# EAGLE board h7-disco (EAGLE 7.7.0)
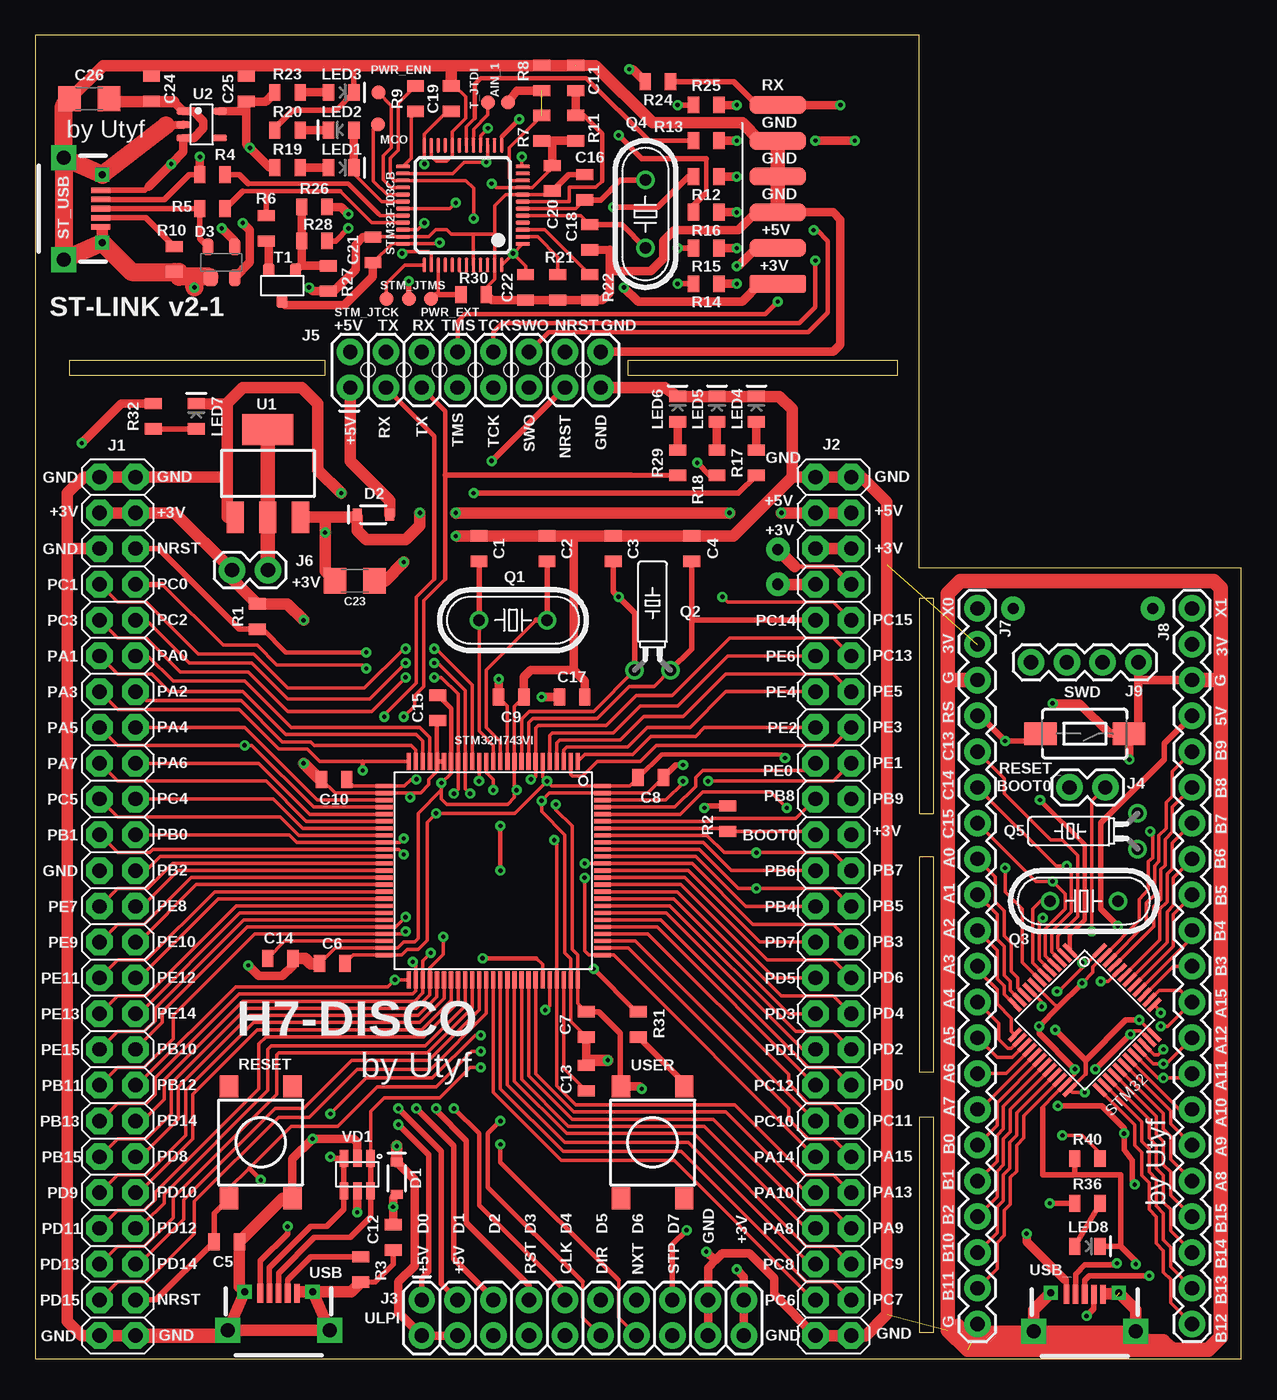
[diagram p1: board, top side]
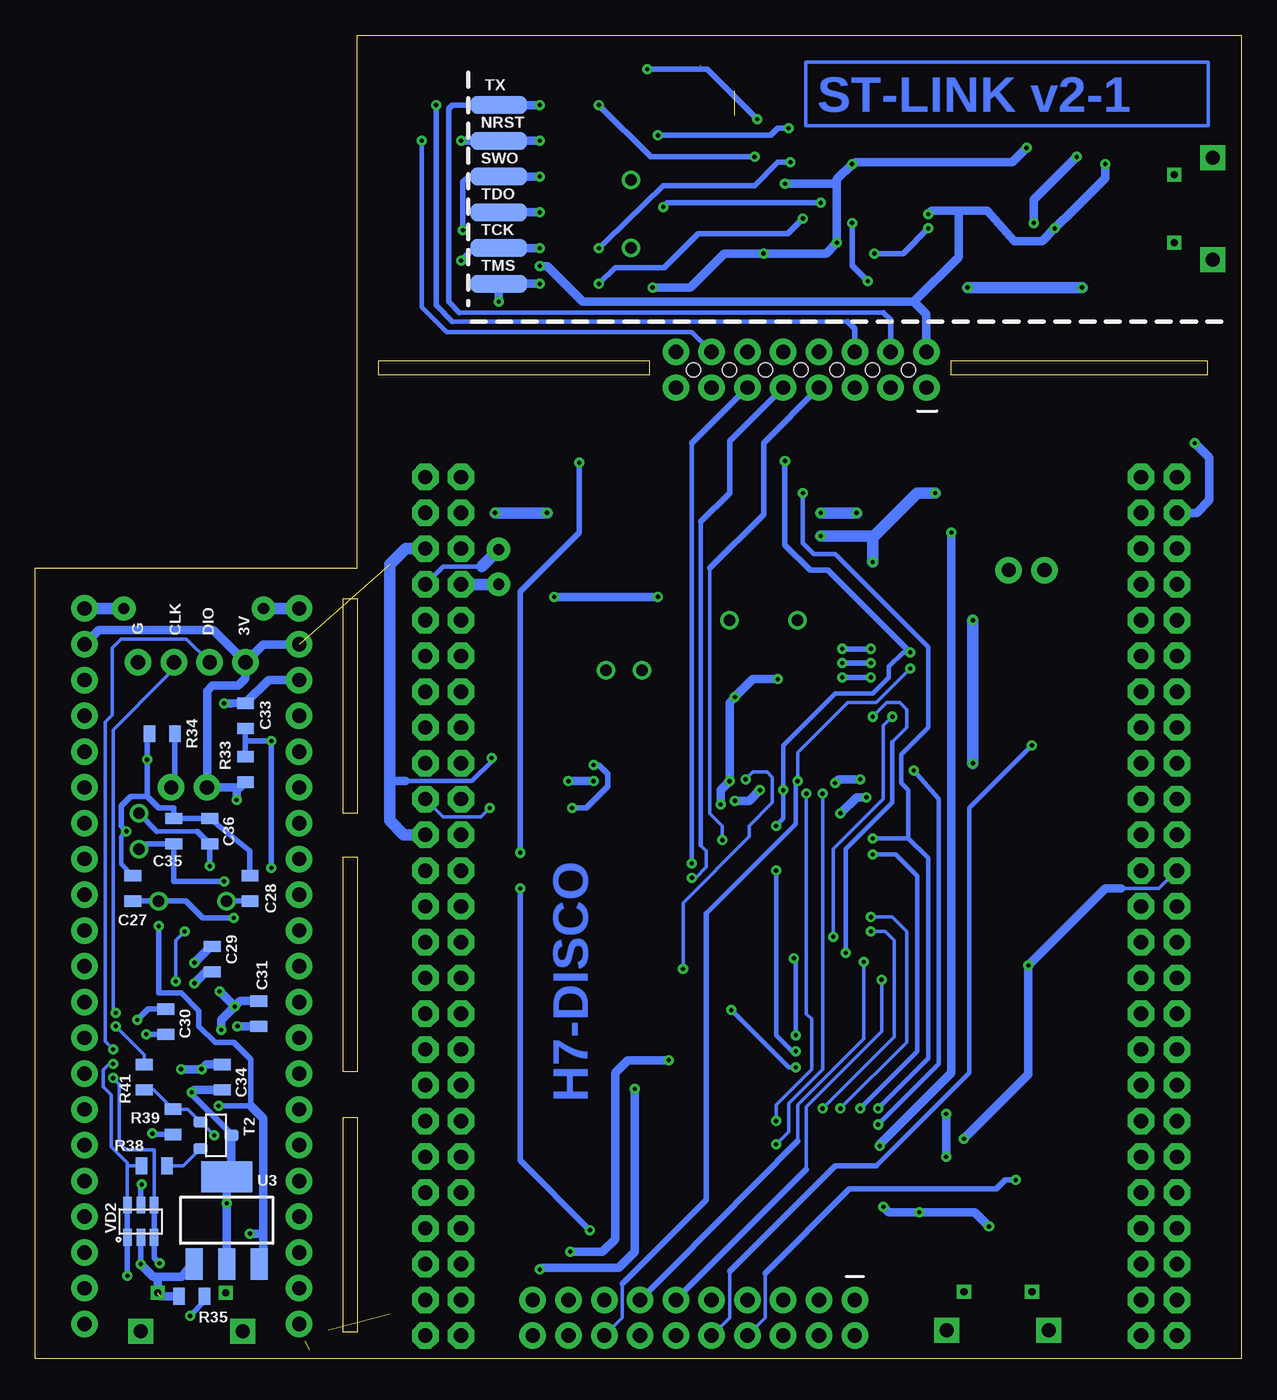
[diagram p2: board, bottom side, seen from below]

Size 85.6 x 93.98 mm. Coordinates in mm from the lower left corner, seen from the top.
Outline: 0,0 85.6,0 85.6,56.13 62.74,56.13 62.74,93.98 0,93.98 0,0
Copper layers (1*16): Top 0.035mm / dielectric 1.5mm / Bottom 0.035mm
Design rules "default *": minimum track width 8mil, minimum drill 12mil, track to track 7mil, track to pad 7mil, pad to pad 7mil, via to via 7mil, smd to smd 7mil, copper to edge 4mil, drill to drill 4mil, minimum pad ring 10mil, minimum via ring 8mil, stop-mask expansion 4mil, vias tented up to drill 0mil, thermal gap 10mil
Holes 1 mm at 23.62,70.23 26.16,70.23 28.7,70.23 31.24,70.23 33.78,70.23 36.32,70.23 38.86,70.23

## Footprints (pad centres in the part's own frame; a part is rotated, then mirrored left to right if it is on the bottom)
TP10R = smd 1 x 1: TP 0,0
0805 = smd 0.8 x 1.2: 1 -0.9,0; 2 0.9,0
1206 = smd 1.6 x 1.8: 1 -1.4,0; 2 1.4,0
PLANAR-6X2 = smd 1.27 x 4: 1 6.35,2.54; 3 3.81,2.54; 5 1.27,2.54; 7 -1.27,2.54; 9 -3.81,2.54; 11 -6.35,2.54 | smd 1.27 x 4 bottom: 2 6.35,2.54; 4 3.81,2.54; 6 1.27,2.54; 8 -1.27,2.54; 10 -3.81,2.54; 12 -6.35,2.54
SOD-323 = smd 0.63 x 0.83: A 1.15,0; C -1.15,0
SOT143 = smd 1 x 1.2: 1 -0.75,-1.1 | smd 0.8 x 1.2: 2 0.95,-1.1; 3 0.95,1.1; 4 -0.95,1.1
2X25 = drill 1.016 pad 1.88 octagon: 1 -11.43,-1.27; 2 -11.43,1.27; 3 -8.89,-1.27; 4 -8.89,1.27; 5 -6.35,-1.27; 6 -6.35,1.27; 7 -3.81,-1.27; 8 -3.81,1.27; 9 -1.27,-1.27; 10 -1.27,1.27; 11 1.27,-1.27; 12 1.27,1.27; 13 3.81,-1.27; 14 3.81,1.27; 15 6.35,-1.27; 16 6.35,1.27; 17 8.89,-1.27; 18 8.89,1.27; 19 11.43,-1.27; 20 11.43,1.27; 21 13.97,-1.27; 22 13.97,1.27; 23 16.51,-1.27; 24 16.51,1.27; 25 19.05,-1.27; 26 19.05,1.27; 27 21.59,-1.27; 28 21.59,1.27; 29 24.13,-1.27; 30 24.13,1.27; 31 26.67,-1.27; 32 26.67,1.27; 33 29.21,-1.27; 34 29.21,1.27; 35 31.75,-1.27; 36 31.75,1.27; 37 34.29,-1.27; 38 34.29,1.27; 39 36.83,-1.27; 40 36.83,1.27; 41 39.37,-1.27; 42 39.37,1.27; 43 41.91,-1.27; 44 41.91,1.27; 45 44.45,-1.27; 46 44.45,1.27; 47 46.99,-1.27; 48 46.99,1.27; 49 49.53,-1.27; 50 49.53,1.27
2X10-MIRROR = drill 1.016 pad 1.88: 1 0,2.54; 2 0,0; 3 2.54,2.54; 4 2.54,0; 5 5.08,2.54; 6 5.08,0; 7 7.62,2.54; 8 7.62,0; 9 10.16,2.54; 10 10.16,0; 11 12.7,2.54; 12 12.7,0; 13 15.24,2.54; 14 15.24,0; 15 17.78,2.54; 16 17.78,0; 17 20.32,2.54; 18 20.32,0; 19 22.86,2.54; 20 22.86,0
1X02 = drill 1.016 pad 1.88: 1 0,0; 2 2.54,0
2X8 = drill 1.016 pad 1.88: 1 0,0; 2 0,2.54; 3 2.54,0; 4 2.54,2.54; 5 5.08,0; 6 5.08,2.54; 7 7.62,0; 8 7.62,2.54; 9 10.16,0; 10 10.16,2.54; 11 12.7,0; 12 12.7,2.54; 13 15.24,0; 14 15.24,2.54; 15 17.78,0; 16 17.78,2.54
1X21 = drill 1.016 pad 1.88: 0 -26.67,0; 1 -24.13,0; 2 -21.59,0; 3 -19.05,0; 4 -16.51,0; 5 -13.97,0; 6 -11.43,0; 7 -8.89,0; 8 -6.35,0; 9 -3.81,0; 10 -1.27,0; 11 1.27,0; 12 3.81,0; 13 6.35,0; 14 8.89,0; 15 11.43,0; 16 13.97,0; 17 16.51,0; 18 19.05,0; 19 21.59,0; 20 24.13,0
1X04 = drill 1.016 pad 1.88: 1 0,0; 2 2.54,0; 3 5.08,0; 4 7.62,0
LED-0805 = smd 0.8 x 1.2: A -0.9,0; C 0.9,0
HC49/S = drill 0.813: 1 -2.413,0; 2 2.413,0
TC26H = drill 0.813: 1 -1.27,0; 2 1.27,0
TACTILE_SWITCH_SMD_6.2MM_TALL = smd 1.55 x 1.3: A1 -3.975,-2.25; A2 3.975,-2.25; B1 -3.975,2.25; B2 3.975,2.25
TACTILE_SWITCH_SMD_6.0X3.5MM = smd 2.3 x 1.6: 1 -3.15,0; 2 3.15,0
MICRO_USB-B_4.85_HORN = smd 1.35 x 0.4: 1 2.993,1.3; 2 2.993,0.65; 3 2.993,0; 4 2.993,-0.65; 5 2.993,-1.3 | drill 1 pad 1.778 square: M1 0.381,-3.619; M2 0.381,3.619 | drill 0.508 pad 1.016 square: M3 3.111,2.413; M4 3.111,-2.413
LQFP48 = smd 0.3 x 1.2: 1 -2.75,-4.25; 2 -2.25,-4.25; 3 -1.75,-4.25; 4 -1.25,-4.25; 5 -0.75,-4.25; 6 -0.25,-4.25; 7 0.25,-4.25; 8 0.75,-4.25; 9 1.25,-4.25; 10 1.75,-4.25; 11 2.25,-4.25; 12 2.75,-4.25; 25 2.75,4.25; 26 2.25,4.25; 27 1.75,4.25; 28 1.25,4.25; 29 0.75,4.25; 30 0.25,4.25; 31 -0.25,4.25; 32 -0.75,4.25; 33 -1.25,4.25; 34 -1.75,4.25; 35 -2.25,4.25; 36 -2.75,4.25 | smd 1.2 x 0.3: 13 4.25,-2.75; 14 4.25,-2.25; 15 4.25,-1.75; 16 4.25,-1.25; 17 4.25,-0.75; 18 4.25,-0.25; 19 4.25,0.25; 20 4.25,0.75; 21 4.25,1.25; 22 4.25,1.75; 23 4.25,2.25; 24 4.25,2.75; 37 -4.25,2.75; 38 -4.25,2.25; 39 -4.25,1.75; 40 -4.25,1.25; 41 -4.25,0.75; 42 -4.25,0.25; 43 -4.25,-0.25; 44 -4.25,-0.75; 45 -4.25,-1.25; 46 -4.25,-1.75; 47 -4.25,-2.25; 48 -4.25,-2.75
TQFP48 = smd 0.25 x 1: 1 -2.75,-4.25; 2 -2.25,-4.25; 3 -1.75,-4.25; 4 -1.25,-4.25; 5 -0.75,-4.25; 6 -0.25,-4.25; 7 0.25,-4.25; 8 0.75,-4.25; 9 1.25,-4.25; 10 1.75,-4.25; 11 2.25,-4.25; 12 2.75,-4.25; 25 2.75,4.25; 26 2.25,4.25; 27 1.75,4.25; 28 1.25,4.25; 29 0.75,4.25; 30 0.25,4.25; 31 -0.25,4.25; 32 -0.75,4.25; 33 -1.25,4.25; 34 -1.75,4.25; 35 -2.25,4.25; 36 -2.75,4.25 | smd 1 x 0.25: 13 4.25,-2.75; 14 4.25,-2.25; 15 4.25,-1.75; 16 4.25,-1.25; 17 4.25,-0.75; 18 4.25,-0.25; 19 4.25,0.25; 20 4.25,0.75; 21 4.25,1.25; 22 4.25,1.75; 23 4.25,2.25; 24 4.25,2.75; 37 -4.25,2.75; 38 -4.25,2.25; 39 -4.25,1.75; 40 -4.25,1.25; 41 -4.25,0.75; 42 -4.25,0.25; 43 -4.25,-0.25; 44 -4.25,-0.75; 45 -4.25,-1.25; 46 -4.25,-1.75; 47 -4.25,-2.25; 48 -4.25,-2.75
LQFP100 = smd 0.3 x 1.2: 1 -6,-7.75; 2 -5.5,-7.75; 3 -5,-7.75; 4 -4.5,-7.75; 5 -4,-7.75; 6 -3.5,-7.75; 7 -3,-7.75; 8 -2.5,-7.75; 9 -2,-7.75; 10 -1.5,-7.75; 11 -1,-7.75; 12 -0.5,-7.75; 13 0,-7.75; 14 0.5,-7.75; 15 1,-7.75; 16 1.5,-7.75; 17 2,-7.75; 18 2.5,-7.75; 19 3,-7.75; 20 3.5,-7.75; 21 4,-7.75; 22 4.5,-7.75; 23 5,-7.75; 24 5.5,-7.75; 25 6,-7.75; 51 6,7.75; 52 5.5,7.75; 53 5,7.75; 54 4.5,7.75; 55 4,7.75; 56 3.5,7.75; 57 3,7.75; 58 2.5,7.75; 59 2,7.75; 60 1.5,7.75; 61 1,7.75; 62 0.5,7.75; 63 0,7.75; 64 -0.5,7.75; 65 -1,7.75; 66 -1.5,7.75; 67 -2,7.75; 68 -2.5,7.75; 69 -3,7.75; 70 -3.5,7.75; 71 -4,7.75; 72 -4.5,7.75; 73 -5,7.75; 74 -5.5,7.75; 75 -6,7.75 | smd 1.2 x 0.3: 26 7.75,-6; 27 7.75,-5.5; 28 7.75,-5; 29 7.75,-4.5; 30 7.75,-4; 31 7.75,-3.5; 32 7.75,-3; 33 7.75,-2.5; 34 7.75,-2; 35 7.75,-1.5; 36 7.75,-1; 37 7.75,-0.5; 38 7.75,0; 39 7.75,0.5; 40 7.75,1; 41 7.75,1.5; 42 7.75,2; 43 7.75,2.5; 44 7.75,3; 45 7.75,3.5; 46 7.75,4; 47 7.75,4.5; 48 7.75,5; 49 7.75,5.5; 50 7.75,6; 76 -7.75,6; 77 -7.75,5.5; 78 -7.75,5; 79 -7.75,4.5; 80 -7.75,4; 81 -7.75,3.5; 82 -7.75,3; 83 -7.75,2.5; 84 -7.75,2; 85 -7.75,1.5; 86 -7.75,1; 87 -7.75,0.5; 88 -7.75,0; 89 -7.75,-0.5; 90 -7.75,-1; 91 -7.75,-1.5; 92 -7.75,-2; 93 -7.75,-2.5; 94 -7.75,-3; 95 -7.75,-3.5; 96 -7.75,-4; 97 -7.75,-4.5; 98 -7.75,-5; 99 -7.75,-5.5; 100 -7.75,-6
SOT-23 = smd 0.8 x 1: 1 -0.95,-1.1; 2 0.95,-1.1; 3 0,1.1
SOT223 = smd 1.219 x 2.235: 1 -2.311,-3.099; 2 0,-3.099; 3 2.311,-3.099 | smd 3.6 x 2.2: 4 0,3.099
SOT23-5 = smd 0.5 x 1: 1 -0.95,-1.3; 2 0,-1.3; 3 0.95,-1.3; 4 0.95,1.3; 5 -0.95,1.3
SOT-23-6L = smd 0.6 x 1.2: 1 -0.95,-2.3; 2 0,-2.3; 3 0.95,-2.3; 4 0.95,0; 5 0,0; 6 -0.95,0

## Placement (x,y rotation side)
AIN_1  TPTP10R  [TP10R]  33.56,89.22 0 top
C1  4.3pF  [0805]  31.5,57.53 270 top
C2  4.3pF  [0805]  36.32,57.53 270 top
C3  2.7pF  [0805]  41.02,57.53 270 top
C4  2.7pF  [0805]  46.61,57.53 270 top
C5  100nF  [0805]  13.59,8.32 180 top
C6  0.1µF  [0805]  21.08,28.07 0 top
C7  0.1µF  [0805]  39.12,23.75 90 top
C8  0.1µF  [0805]  43.69,41.27 180 top
C9  0.1µF  [0805]  33.78,46.99 180 top
C10  0.1µF  [0805]  21.21,41.15 180 top
C11  100nF  [0805]  38.35,90.93 90 top
C12  0.1µF  [0805]  25.4,8.64 90 top
C13  2.2µF  [0805]  39.12,19.94 90 top
C14  2.2µF  [0805]  17.4,28.45 0 top
C15  0.1µF  [0805]  28.57,46.23 90 top
C16  10pF  [0805]  38.99,83.19 90 top
C17  0.1µF  [0805]  38.1,46.99 0 top
C18  10pF  [0805]  39.37,79.63 270 top
C19  100nF  [0805]  29.53,89.47 90 top
C20  100nF  [0805]  36.7,83.82 270 top
C21  100nF  [0805]  23.97,78.74 90 top
C22  100nF  [0805]  34.8,76.07 90 top
C23  1µF  [1206]  22.67,55.24 180 top
C24  100nF  [0805]  8.26,90.17 270 top
C25  0.1uF  [0805]  14.99,90.17 90 top
C26  1µF  [1206]  3.84,89.47 0 top
C27  10pF  [0805]  78.68,33.4 270 bottom
C28  10pF  [0805]  70.36,33.4 90 bottom
C29  0.1µF  [0805]  73.03,28.38 90 bottom
C30  0.1µF  [0805]  76.33,23.94 90 bottom
C31  0.1µF  [0805]  69.72,24.51 90 bottom
C33  0.1µF  [0805]  70.68,45.66 270 bottom
C34  0.1µF  [0805]  72.33,20 90 bottom
C35  2.7pF  [0805]  75.76,37.47 270 bottom
C36  2.7pF  [0805]  73.22,37.47 270 bottom
CN2  M06X2  [PLANAR-6X2]  50.16,82.68 270 top
D1  BAT60JFILM  [SOD-323]  25.65,12.83 270 top
D2  BAT60JFILM  [SOD-323]  24,59.94 0 top
D3  SP0503BAHT  [SOT143]  13.21,77.85 0 top
J1  CONN_25X2  [2X25]  5.84,51.18 270 top
J2  CONN_25X2  [2X25]  56.64,51.18 270 top
J3  ULPI  [2X10-MIRROR]  27.43,1.65 0 top
J4  BOOT0  [1X02]  73.41,40.58 0 top
J5  ST-LINK  [2X8]  22.35,68.96 0 top
J6  +3V3  [1X02]  13.97,56.01 0 top
J7  [1X21]  66.87,26.61 270 top
J8  [1X21]  82.11,26.61 270 top
J9  SWD  [1X04]  70.68,49.47 0 top
LED1  Green  [LED-0805]  21.72,84.58 0 top
LED2  Red  [LED-0805]  21.72,87.25 180 top
LED3  Yellow  [LED-0805]  21.72,89.92 0 top
LED4  Green  [LED-0805]  51.18,67.44 90 top
LED5  Blue  [LED-0805]  48.39,67.44 90 top
LED6  Red  [LED-0805]  45.59,67.44 90 top
LED7  Yellow  [LED-0805]  11.43,66.93 90 top
LED8  Green  [LED-0805]  74.68,8 0 top
MCO  TPTP10R  [TP10R]  24.32,87.63 0 top
PWR_ENN  TPTP10R  [TP10R]  24.35,89.92 0 top
PWR_EXT  TPTP10R  [TP10R]  28.1,75.25 0 top
Q1  8 MHz  [HC49/S]  33.91,52.45 0 top
Q2  32KHz  [TC26H]  43.81,48.9 0 top
Q3  8 MHz  [HC49/S]  74.42,32.51 0 top
Q4  8 MHz  [HC49/S]  43.31,81.28 270 top
Q5  32KHz  [TC26H]  78.23,37.47 90 top
R1  100K  [0805]  15.75,52.7 90 top
R2  10K  [0805]  49.15,38.35 90 top
R3  100K  [0805]  23.11,6.35 270 top
R4  22  [0805]  12.57,84.07 0 top
R5  22  [0805]  12.57,81.66 0 top
R6  1K5  [0805]  16.38,80.26 90 top
R7  4K7  [0805]  35.94,87.38 270 top
R8  4K7  [0805]  35.94,90.93 270 top
R9  100  [0805]  26.99,89.47 90 top
R10  100K  [0805]  9.87,78.07 270 top
R11  100K  [0805]  38.35,87.38 270 top
R12  22  [0805]  47.62,83.95 180 top
R13  22  [0805]  47.62,86.49 180 top
R14  22  [0805]  47.62,76.33 180 top
R15  22  [0805]  47.62,78.87 180 top
R16  22  [0805]  47.62,81.41 180 top
R17  680  [0805]  51.18,63.63 90 top
R18  680  [0805]  48.39,63.63 90 top
R19  100  [0805]  17.91,84.58 180 top
R20  100  [0805]  17.91,87.25 180 top
R21  10K  [0805]  37.08,76.07 90 top
R22  10K  [0805]  39.37,76.07 270 top
R23  680  [0805]  17.91,89.92 180 top
R24  22  [0805]  44.2,90.68 180 top
R25  22  [0805]  47.62,89.03 180 top
R26  10K  [0805]  19.81,81.79 0 top
R27  36K  [0805]  20.8,76.71 90 top
R28  100  [0805]  19.81,79.38 0 top
R29  1K  [0805]  45.59,63.63 90 top
R30  4K7  [0805]  31.11,75.56 0 top
R31  330  [0805]  42.8,23.75 270 top
R32  1K  [0805]  8.38,66.93 270 top
R33  100K  [0805]  70.68,41.85 90 bottom
R34  10K  [0805]  76.58,44.39 0 bottom
R35  100K  [0805]  74.49,4.45 180 bottom
R36  1K  [0805]  74.68,11.05 0 top
R38  1K5  [0805]  77.15,13.72 180 bottom
R39  10K  [0805]  75.82,16.83 270 bottom
R40  36K  [0805]  74.68,14.22 0 top
R41  100  [0805]  77.85,20 90 bottom
RESET  [TACTILE_SWITCH_SMD_6.2MM_TALL]  16,15.37 270 top
RESET_  RESET  [TACTILE_SWITCH_SMD_6.0X3.5MM]  74.49,44.39 180 top
ST_USB  USB  [MICRO_USB-B_4.85_HORN]  1.65,81.66 0 top
STM32  STM32F303CCT  [LQFP48]  74.49,24.07 225 top
STM32F103CB  STM32F103CBT6  [TQFP48]  30.35,81.92 90 top
STM32H743VI  STM32H743VIT  [LQFP100]  32.51,34.67 180 top
STM_JTCK  TPTP10R  [TP10R]  24.92,75.25 0 top
STM_JTMS  TPTP10R  [TP10R]  26.51,75.25 0 top
T1  9013  [SOT-23]  17.53,76.2 180 top
T2  9013  [SOT-23]  72.77,15.88 270 bottom
T_JTDI  TPTP10R  [TP10R]  32.13,89.22 0 top
U1  LM1117-33  [SOT223]  16.51,62.87 0 top
U2  LDO-3.3V  [SOT23-5]  11.81,87.63 270 top
U3  LM1117-33  [SOT223]  72.01,9.84 0 bottom
USB  usb  [MICRO_USB-B_4.85_HORN]  17.27,1.65 90 top
USB_  usb  [MICRO_USB-B_4.85_HORN]  74.49,1.59 90 top
USER  [TACTILE_SWITCH_SMD_6.2MM_TALL]  43.81,15.37 90 top
VD1  USBLC6-2SC6  [SOT-23-6L]  22.86,11.94 180 top
VD2  USBLC6-2SC6  [SOT-23-6L]  78.11,10.92 0 bottom

## Tracks (layer width: path | path; a pad name or v marks a point on that pad's centre or on a via)
+3V3  (via drill 0.3)  (1 unrouted)
  Top 0.254: STM32H743VI.11 33.51,46.36 C9.2 32.88,47.23 | C10.2 21.29,40.17 STM32H743VI.27 26.61,40.17 | C6.2 22.59,28.67 STM32H743VI.50 26,28.67 26.42,29.08 27.18,29.08 27.81,29.72 27.81,38.1 v28.45,38.73 34.04,38.73 v36.32,41.02 | STM32H743VI.6 36.01,41.33 v36.32,41.02 | C8.2 42.18,40.67 STM32H743VI.100 36.67,40.67 v36.32,41.02 | 52.96,42.93 v53.21,42.67 | v36.96,39.37 36.96,38.99 38.1,37.85 38.1,29.08 38.51,28.67 STM32H743VI.75 38.51,25.25 C7.2 39.12,24.64 | 26.61,40.17 27.34,40.17 27.94,40.77 27.94,41.15 28.51,41.72 STM32H743VI.21 | USER.B2 41.53,19.38 | v26.61,39.88 26.61,40.17 | v74.49,18.92 73.6,18.92 STM32.24 74.55,20.24 | STM32.9 71.5,25.27 v71.44,25.02 | STM32.48 74.45,27.92 | 74.45,27.92 72.63,26.1 v72.52,26.1 | STM32.1 v74.3,28.13 74.45,27.92 | v78.36,24.07 78.5,23.94 STM32.36
  Top 0.305: STM32H743VI.20 STM32H743VI.21 28.51,45.27 C15.1 | C10.2 20.19,41.15 | C8.2 44.45,42.93 52.96,42.93 | 74.55,21.21 74.55,20.24 | STM32.1 73.42,30.12 74.49,31.18 74.49,36.51 v71.31,39.69
  Top 0.406: 41.53,19.38 41.53,23.11 40.01,24.64 39.12,24.64 | v72.39,23.37 74.55,21.21 77.41,24.07 v78.36,24.07 | R36.1 v72.01,11.05
  Top 0.61: 32.88,47.23 v32.89,48.26 | C17.1 v35.94,46.99 | v49.78,6.35 50.29,5.84 J3.19 J3.20 | v43.05,19.18 42.89,19.34 USER.B2 | v3.3,65.02 6.1,67.82 R32.1
  Top 0.813: J1.3 J1.4 9.91,60.07 J6.1 13.97,55.38 R1.2 17.9,53.6 v19.05,52.45 | J2.5 J2.6 | 20.19,41.15 v19.05,42.29
  Bottom 0.254: v53.21,42.67 53.21,42.42 | C29.2 73.14,29.29 | 71.67,13.28 U3.4 | T2.3 71.67,15.98 | 74.49,18.8 v74.49,18.92
  Bottom 0.305: 53.21,42.42 54.61,41.02 59.31,41.02
  Bottom 0.406: C30.2 77.59,24.84 v78.36,24.07 | 71.67,15.98 74.49,18.8
  Bottom 0.61: v32.89,48.26 34.67,48.26 v35.94,46.99 36.32,46.61 v36.32,41.02 36.96,40.39 v36.96,39.37 | 59.31,41.02 60.45,41.02 60.45,38.35 59.31,37.21 J2.22 | v49.78,6.35 49.66,6.48 44.2,6.48 43.05,7.62 v43.05,19.18 | v28.45,38.73 27.3,39.88 v26.61,39.88 | J1.3 3.17,60.07 2.29,60.96 2.29,64.01 v3.3,65.02 | U3.2 v72.01,11.05 U3.4 | v72.52,26.1 v71.44,25.02 | v71.44,25.02 72.39,24.07 v72.39,23.37 | J9.1 70.67,48.32 71.18,47.82 73.03,47.82 73.41,47.43 J4.1 71.5,40.58 | C31.2 71.05,25.41 v71.44,25.02 | C34.1 74.31,19.1 v74.49,18.92 | 73.14,29.29 v74.3,28.13 | J9.1 69.41,50.74 J7.1 | J8.1 81.09,51.75 72.96,51.75 J9.1 | T2.3 71.67,13.28 | 71.5,40.58 71.05,40.58 R33.1 | v71.31,39.69 71.31,40.39 71.5,40.58
  Bottom 0.813: v19.05,52.45 v19.05,42.29 | J2.22 59.44,37.21 60.45,38.23 60.45,41.02 60.45,56.39 59.31,57.53 J2.6
+5V  (via drill 0.3)
  Top 0.406: 22.86,59.77 22.68,59.77 D2.C
  Top 0.61: D1.C 26.92,12.71 26.92,6.6 25.78,5.46 25.78,3.3 J3.2 J3.4
  Top 0.813: J2.4 J2.3 v52.96,60.07 | U1.3 20.57,59.77 | 20.57,59.77 22.68,59.77 | v27.3,60.07 27.3,59.18 26.29,58.17 23.5,58.17 22.86,58.8 22.86,59.77 | v29.84,60.07 v49.28,60.07 | D1.C v25.65,15.11 | 20.57,59.77 v20.57,58.67 20.57,55.94 C23.2
  Bottom 0.61: v25.65,15.11 25.65,15.24 20.57,20.32 v20.57,58.67
  Bottom 0.813: v27.3,60.07 v29.84,60.07 | v49.28,60.07 v52.96,60.07
AIN_1  (1 unrouted)
  Top 0.254: STM32F103CB.10 33.81,83.67 33.66,83.82 33.66,85.99 R7.1
  Top 0.61: AIN_1.TP 34.18,90.03 R8.2
BOOT0
  Top 0.254: STM32H743VI.94 48.93,37.67 R2.1 55.13,37.45 J2.21
BOOT0_  (via drill 0.3)
  Top 0.254: STM32.44 76.16,26.8 v75.63,26.8 | v74.99,30.35 74.99,39.62 J4.2
  Bottom 0.254: v74.99,30.35 75.63,29.72 v75.63,26.8
  Bottom 0.406: R34.2 75.68,40.84 J4.2
D+1
  Top 0.406: D3.4 11.67,79.54 R5.1 ST_USB.3
D-1  (via drill 0.3)
  Top 0.406: R4.1 10.92,84.07 9.16,82.31 ST_USB.2
  Top 0.61: v14.73,80.64 15.24,80.14 15.24,77.85 D3.2 | v11.68,85.34 11.68,83.95 R4.1
  Bottom 0.61: v14.73,80.64 14.73,82.3 v11.68,85.34
GND  (via drill 0.3)  (4 unrouted)
  Top 0.254: C7.1 38.01,23.95 STM32H743VI.74 38.01,28.41 37.59,28.83 37.59,37.21 35.94,38.86 v35.94,39.62 36.49,40.17 STM32H743VI.99 43.48,40.17 C8.1 44.58,41.27 | C9.1 34.01,46.32 STM32H743VI.10 34.01,40.41 | C10.1 22.59,40.67 STM32H743VI.26 26.19,40.67 26.67,41.15 v27.05,41.15 | 20.04,28.06 C6.1 21.29,29.17 STM32H743VI.49 25.74,29.17 26.16,29.59 26.92,29.59 27.18,29.84 27.18,38.73 28.83,40.39 v28.83,40.89 | R2.2 | 40.14,58.42 C3.1 | 29.96,58.43 v29.84,58.42 | 34.01,40.41 34.01,39.85 33.53,39.37 29.21,39.37 28.83,39.75 v28.83,40.89 | 34.01,40.41 v34.16,40.39 | STM32H743VI.19 29.51,41.58 v28.83,40.89 | v73.79,20.57 73.79,20.19 STM32.23 72.33,18.73 71.5,17.91 71.5,17.78 | 72.58,24.96 72.14,25.36 STM32.8 | v74.3,26.67 75.06,27.43 75.06,27.82 STM32.47 78.36,31.12 78.36,32.64 78.99,33.34 78.99,35.31 79.31,35.56 79.31,37.27 v79.12,37.47 | v77.72,23.05 77.98,23.3 78.43,23.3 STM32.35 | RESET_.1 78.3,45.05
  Top 0.305: C2.1 36.83,58.43 37.84,58.43 38.23,58.04 | STM32H743VI.19 29.51,46.19 C15.2
  Top 0.406: R2.2 47.62,39.24 v47.5,39.12 | 44.58,41.27 45.47,42.16 v45.97,42.16 | 39.49,21.21 C13.2 | USB.5 USB.M4 | USB.M1 20.97,2.03 | R3.2 24.13,5.46 25.4,6.73 C12.1 | USB_.M4 USB_.5 | v73.79,20.57 71.25,23.11 v71.25,23.62 72.58,24.96 v74.3,26.67 | v78.11,6.73 78.11,6.92 77.03,8 | 77.03,8 77.03,13.08 73.66,13.08 | 73.66,13.08 71.5,13.08 71.5,17.78 | LED8.C 77.03,8 | v75.25,20.57 v77.72,23.05 | RESET_.1 77.66,44.36 | R40.1 73.78,13.2 73.66,13.08
  Top 0.61: 38.23,58.04 38.23,48.9 | 38.23,48.9 38.99,48.14 C17.2 | C9.1 34.68,48.4 35.18,48.9 38.23,48.9 | VD1.2 22.86,15.37 22.61,15.62 v19.68,15.62 18.25,14.19 RESET.B2 | 48.26,6.99 47.75,6.48 J3.17 J3.18 | 48.26,6.99 48.77,7.49 50.67,7.49 52.45,5.71 52.45,4.57 J2.49 | C7.1 C13.2 | v47.62,7.62 48.26,6.99 | C14.2 18.3,27.95 17.53,27.18 15.88,27.18 v15.11,27.94 | RESET_.1 76.26,44.39 74.11,46.55 v72.2,46.55 | 78.3,45.05 78.3,48.2 | 78.3,48.2 J9.4 | J8.2 78.3,48.2 | 77.66,44.36 v77.66,42.55
  Top 0.813: J1.50 J1.49 3.3,1.65 2.29,2.67 2.29,57.53 | J2.49 J2.50 58.93,1.65 60.45,3.17 60.45,60.83 58.67,62.61 J2.2 J2.1 53.98,62.61 | 53.98,62.61 53.71,62.61 52.58,61.47 49.54,58.43 C4.1 C3.1 36.83,58.43 | C2.1 C1.1 29.96,58.43 | J1.5 2.29,57.53 | 2.29,57.53 2.29,61.47 3.43,62.61 J1.1 J1.2 13.64,62.61 | v21.72,61.47 20.07,63.12 20.07,67.82 18.92,68.96 14.73,68.96 13.64,67.87 13.64,67.82 | v40.64,21.21 39.49,21.21 | J5.15 44.69,68.96 LED6.C LED5.C LED4.C 52.82,68.34 53.72,67.44 53.72,62.87 53.98,62.61 | U1.1 13.64,59.77 13.64,62.61 | 13.64,62.61 13.64,67.82 | LED7.C 12.49,67.81 13.64,67.82 | 20.04,28.06 19.57,28.06 19.18,28.45 C14.2 | USB.M4 USB.M1 USB.M2 USB.M3 14.49,5.13 C5.1 | USB.M4 22.43,4.76 R3.2 | USB_.M4 78.11,3.49 USB_.M1 USB_.M2 | USB_.M2 70.87,3.49 USB_.M3 | J7.20 67.37,1.97 USB_.M2 | RESET.B2 17.55,11.39 14.48,8.32 | USB.M4 18.8,4.76 | 76.9,4.64 76.01,4.64 | C23.1 24.83,55.24 v26.16,56.58
  Top 1.016: J1.50 13.27,1.65 USB.M2 | 84.14,48.2 84.14,54.74 83.63,55.24 65.66,55.24 64.77,54.36 64.77,2.03 66.17,0.64 83.25,0.64 84.14,1.52 84.14,48.2 | 65.47,2.35 66.48,1.27 80.07,1.27 80.52,0.83 | J7.2 64.83,48.2 | J8.2 84.14,48.2
  Bottom 0.254: 8.51,33.4 5.84,33.4 J1.23
  Bottom 0.305: C27.1 79.5,35.13 79.5,37.08 v79.12,37.47
  Bottom 0.406: v45.97,42.16 45.59,42.16 44.96,41.53 44.96,40.64 46.48,39.12 v47.5,39.12 | U3.1 74.49,6.74 | v78.11,6.73 VD2.2 | C28.2 70.36,36.08 C36.1 C35.1 75.75,39.12 76.83,39.12 77.66,39.94 | v79.12,37.47 79.5,37.85 79.5,39.24 78.8,39.94 77.66,39.94 | C30.1 77.35,23.04 v77.72,23.05 | 77.66,39.94 v77.66,42.55 77.66,44.13 R34.1 | 71.13,23.61 v71.25,23.62 | C29.1 73.46,27.5 | 76.9,5.78 76.96,5.84
  Bottom 0.61: v35.94,39.62 34.92,39.62 v34.16,40.39 | v27.05,41.15 28.57,41.15 v28.83,40.89 | v19.68,15.62 15.11,20.19 v15.11,27.94 9.65,33.4 8.51,33.4 | v40.64,21.21 43.56,21.21 44.45,20.32 44.45,8.51 45.34,7.62 v47.62,7.62 | R35.2 76.71,4.45 | 74.49,6.74 75.18,5.84 76.96,5.84 77.22,5.84 v78.11,6.73 | v75.25,20.57 v73.79,20.57 73.46,20.9 C34.2 | v72.2,46.55 71.69,46.55 C33.1 69.03,48.2 J7.2 | C31.1 71.13,23.61 | 73.46,27.5 v74.3,26.67 | USB_.M4 76.9,5.78
  Bottom 0.813: v29.84,58.42 26.23,58.42 | 26.23,58.42 26.04,58.42 22.99,61.47 v21.72,61.47 | v26.16,56.58 26.16,58.36 26.23,58.42
ID
  Top 0.406: USB.4 17.92,5.6 18.29,5.97 19.55,7.24 R3.1
ID_  (via drill 0.3)
  Top 0.406: USB_.4 75.14,3.57 v74.61,3.05
  Bottom 0.406: R35.1 73.58,4.08 v74.61,3.05
LED_STLINK
  Top 0.254: STM32F103CB.30 24.61,82.17 22.51,84.26 LED1.C
  Top 0.61: LED2.A LED1.C
MCO
  Top 0.254: STM32F103CB.29 24.97,82.67 24,83.63 24,87.31 MCO.TP
N$1
  Top 0.254: STM32H743VI.13 32.51,43.56 31.5,44.58 Q1.1
  Top 0.406: Q1.1 C1.2
N$2
  Top 0.254: STM32H743VI.12 33.01,43.82 32,44.83 32,48.9 35.56,52.45
  Top 0.406: 35.56,52.45 Q1.2 C2.2
N$3
  Top 0.254: STM32F103CB.7 37.91,82.17 37.91,83.19 39.78,83.19 40.23,83.63
  Top 0.305: R11.1 38.92,88.3 40.23,87 40.23,83.63
  Top 0.61: C11.1 R11.1
N$4
  Top 0.254: STM32F103CB.5 38.73,81.17 C18.1
  Top 0.406: C18.1 41.66,80.52 Q4.2
N$5
  Top 0.254: STM32F103CB.6 38.37,81.67 C16.1
  Top 0.406: Q4.1 41.53,83.69 40.12,82.28 C16.1
N$6
  Top 0.61: R26.1 R28.1 18.91,77.74 T1.1 18.78,77.61 R27.2
N$7
  Top 0.61: R20.1 LED2.C
N$8
  Top 0.61: R19.1 LED1.A
N$10
  Top 0.61: LED5.A R18.2
N$11
  Top 1.016: J6.2 U1.2 U1.4
N$12
  Top 0.61: R23.1 LED3.A
N$13
  Top 0.61: T1.2 16.58,79.17 R6.1
N$14
  Top 0.61: LED4.A R17.2
N$15
  Top 0.254: STM32F103CB.2 35.65,79.67 37.08,78.23 R21.2
N$16
  Top 0.254: STM32F103CB.3 36.18,80.17 R22.1
N$17
  Top 0.406: R32.2 LED7.A
N$19
  Top 0.406: ST_USB.4 7.84,81.01 R10.1
N$20
  Bottom 0.254: R38.1 75.08,13.72 T2.2
N$21  (via drill 0.3)
  Top 0.254: v72.9,15.88 74.3,15.88 75.58,14.59 R40.2
  Bottom 0.254: v72.9,15.88 73.85,16.82 T2.1 74.77,17.73 R39.1 77.19,19.1 R41.1
N$22
  Top 0.61: LED6.A R29.2
N$23
  Top 0.406: USER.A2 45.98,19.68 R31.2
N$24
  Top 0.406: LED8.A R36.2
N$25
  Bottom 0.254: 2.35,92.08 2.35,87.57 30.92,87.57 30.92,92.08 2.35,92.08
NRST  (via drill 0.3)
  Top 0.254: STM32H743VI.14 32.01,41.65 32.51,41.15 v32.51,40.39 | v31.62,21.84 30.99,21.84 28.45,19.3 24.26,19.3 21.46,16.51 18.16,16.51 15.18,13.53 13.75,12.1 RESET.A2 | 16.14,51.8 R1.1
  Top 0.305: v23.5,50.16 17.78,50.16 16.14,51.8 | v33.02,34.67 v33.02,37.85 | v16,12.7 15.18,13.53
  Top 0.406: J1.6 8.76,57.53 14.49,51.8 R1.1 | J5.13 v32.38,63.75 | RESET.A2 12.69,10.33 C5.2 8.56,4.19 J1.48
  Bottom 0.254: v31.62,21.84 31.88,21.84 | 33.78,6.1 33.78,2.92 J3.8
  Bottom 0.305: v23.5,50.16 24,50.16 25.02,49.15 25.02,48.39 26.16,47.24 28.83,47.24 32.51,43.56 v32.51,40.39 32.51,38.35 v33.02,37.85 | 31.88,21.84 33.02,22.99 v33.02,34.67
  Bottom 0.406: 33.78,6.1 27.81,12.06 17.4,12.06 16.76,12.7 v16,12.7 | v32.38,63.75 32.38,57.78 30.61,56.01 29.34,56.01 v23.5,50.16
NRST_  (via drill 0.3)
  Top 0.254: STM32.7 70.04,28.16 70.04,31.94 68.83,33.15 v68.83,34.86 | 67.06,45.66 J7.3 | 70.83,43.88 RESET_.2
  Top 0.406: 67.06,45.66 v68.83,43.88 70.83,43.88
  Bottom 0.406: v68.83,34.86 v68.83,43.88 70.67,43.88 | R33.2 70.67,43.88 | 70.67,43.88 C33.2
PA0
  Top 0.254: STM32H743VI.22 28.01,44.12 27.3,44.83 18.16,44.83 14.86,48.13 9.78,48.13 8,49.91 J1.12
PA0_
  Top 0.254: STM32.10 69.72,26.35 69.72,27.05 69.28,27.5 69.28,29.53 68.77,30.04 68.77,31.81 68.14,32.45 68.14,34.23 J7.7
PA1
  Top 0.254: STM32H743VI.23 27.51,43.86 27.05,44.32 17.78,44.32 14.73,47.37 9.53,47.37 8.26,48.64 5.84,48.64 J1.11
PA1_
  Top 0.254: STM32.11 69.22,26.16 69.22,26.8 68.77,27.24 68.77,29.27 68.26,29.78 68.26,31.56 J7.8
PA2
  Top 0.254: STM32H743VI.24 27.01,43.22 26.67,43.56 19.81,43.56 19.56,43.81 17.53,43.81 14.61,46.74 7.87,46.74 J1.14
PA2_
  Top 0.254: STM32.12 68.77,25.89 68.77,26.48 68.26,26.99 68.26,29.02 J7.9
PA3  (via drill 0.3)
  Top 0.254: STM32H743VI.25 23.24,42.42 20.19,42.42 19.3,43.31 17.27,43.31 14.48,46.1 5.84,46.1 J1.13
  Top 0.305: v23.24,41.78 23.24,42.42
  Top 0.406: v25.78,16.64 27.94,14.48 27.94,6.22 27.43,5.71 J3.1
  Bottom 0.305: v25.78,16.64 21.46,20.95 21.46,39.75 v23.24,41.78
PA3_
  Top 0.254: STM32.13 69.28,23.26 69.28,24.19 68.26,25.21 68.26,26.23 66.86,27.62 J7.10
PA4
  Top 0.254: STM32H743VI.28 20.02,39.67 14.86,44.83 J1.16
PA4_
  Top 0.254: STM32.14 69.27,22.04 69.03,22.04 68.39,22.67 68.39,23.81 J7.11
PA5  (via drill 0.3)
  Top 0.254: STM32H743VI.29 19.76,39.17 15.37,43.56 v14.86,43.56 5.84,43.56 J1.15
  Bottom 0.254: 36.32,6.22 36.32,2.92 J3.10
  Bottom 0.305: 25.91,13.72 19.3,20.32 19.3,39.12 v14.86,43.56
  Bottom 0.406: 36.32,6.22 28.83,13.72 25.91,13.72
PA5_
  Top 0.254: STM32.15 69.34,21.4 68.26,21.4 J7.12
PA6
  Top 0.254: STM32H743VI.30 19.5,38.67 15.88,42.29 J1.18
PA6_
  Top 0.254: STM32.16 68.91,20.26 J7.13
PA7
  Top 0.254: STM32H743VI.31 19.23,38.17 16.38,41.02 5.84,41.02 J1.17
PA7_
  Top 0.254: STM32.17 67.08,17.72 J7.14
PA8
  Top 0.254: STM32H743VI.67 34.51,19.84 37.85,16.51 47.5,16.51 54.48,9.53 55.12,9.53 J2.43
PA8_
  Top 0.254: STM32.29 80.07,17.42 80.07,16.32 80.58,15.81 80.58,14.16 J8.16
PA9
  Top 0.254: STM32H743VI.68 35.01,20.11 38.1,17.02 48.13,17.02 54.61,10.54 56.64,10.54 J2.44
PA9_
  Top 0.254: STM32.30 80.58,17.62 80.58,16.7 J8.15
PA10
  Top 0.254: STM32H743VI.69 35.51,20.24 38.23,17.53 49.02,17.53 54.61,11.94 55.24,11.94 J2.41
PA10_
  Top 0.254: STM32.31 81.19,17.72 J8.14
PA11  (via drill 0.3)
  Top 0.254: v20.95,17.4 23.5,19.94 28.19,19.94 31.24,22.99 v31.62,22.99 | STM32H743VI.70 36.01,28 35.56,28.45
  Top 0.305: 20.95,14.24 v20.95,14.35 | 35.56,28.45 v31.75,28.45
  Top 0.406: 20.95,14.24 VD1.3 VD1.4 21.91,10.61 20.7,9.4 19.56,9.4 16.62,6.46 USB.2
  Bottom 0.254: 31.62,28.32 v31.75,28.45
  Bottom 0.305: v31.62,22.99 31.62,28.32
  Bottom 0.61: v20.95,14.35 v20.95,17.4
PA11_  (via drill 0.3)
  Top 0.254: STM32.32 79.67,19.94 v80.07,19.94 81.79,19.94 J8.13
  Top 0.406: USB_.2 73.83,6.02 74.49,6.67 76.58,6.67 v76.77,6.79
  Bottom 0.254: VD2.4 77.15,12.83 77.15,14.86 79.12,14.86 79.63,15.37 79.63,19.49 v80.07,19.94
  Bottom 0.406: v76.77,6.79 77.15,7.18 VD2.3 VD2.4
PA12  (via drill 0.3)
  Top 0.254: v31.62,20.7 30.86,20.7 28.7,18.54 24.77,18.54 23.81,17.59 VD1.1 | STM32H743VI.71 36.51,25.08 v36.2,24.77
  Top 0.406: VD1.1 VD1.6 23.81,10.09 22.35,8.64 19.81,8.64 17.27,6.1 USB.3
  Bottom 0.305: v31.62,20.7 32.13,20.7 v36.2,24.77
PA12_  (via drill 0.3)
  Top 0.254: STM32.33 79.36,20.95 v80.07,20.95 80.26,20.95 J8.12
  Top 0.406: USB_.3 74.49,5.59 74.8,5.91 v79.06,5.91
  Bottom 0.254: VD2.6 79.06,13.59 79.06,13.72 | 79.06,13.72 79.06,13.91 80.2,15.05 80.2,18.73 80.77,19.3 80.77,20.51 80.33,20.95 v80.07,20.95 | R38.2 79.06,13.72
  Bottom 0.406: v79.06,5.91 79.06,7.24 VD2.1 VD2.6
PA13  (via drill 0.3)
  Top 0.254: J2.42 56.64,13.08 54.61,13.08 49.66,18.03 38.35,18.03 37.01,19.38 STM32H743VI.72 37.01,36.65 v36.83,36.83
  Bottom 0.254: v36.83,36.83 36.83,37.85 37.72,38.73 37.72,56.13
  Bottom 0.406: 37.72,56.13 33.91,59.94 33.91,65.02 J5.7
PA13_  (via drill 0.3)
  Top 0.254: STM32.34 79.44,21.59 79.69,21.59 v80.07,21.97
  Bottom 0.254: J9.2 74.87,51.12 79.5,51.12 80.14,50.48 80.14,45.72 80.64,45.21 80.64,22.54 v80.07,21.97
PA14  (via drill 0.3)
  Top 0.254: J2.39 41.05,28.67 STM32H743VI.76 39.27,28.67 38.99,28.96 v38.99,34.16
  Bottom 0.254: v38.99,34.16 38.73,34.16 37.97,34.92 37.97,36.07 38.35,36.45
  Bottom 0.305: 38.35,36.45 38.35,59.44
  Bottom 0.406: 38.35,59.44 36.32,61.47 36.32,65.15 J5.9
PA14_  (via drill 0.3)
  Top 0.254: STM32.37 79.82,24.7 v79.88,24.57
  Bottom 0.254: v79.88,24.57 80.07,24.77 80.07,44.64 76.45,48.32 75.75,49.02 J9.3
PA15
  Top 0.254: STM32H743VI.77 42.08,29.17 53.47,17.78 53.47,17.02 54.86,15.62 56.64,15.62 J2.40
PA15_  (via drill 0.3)
  Top 0.254: STM32.38 79.76,26.16 81.28,26.16 J8.11 80.39,23.62 v79.88,23.62
  Bottom 0.254: R41.2 77.85,21.59 v79.88,23.62
PB0  (via drill 0.3)
  Top 0.254: J1.22 18.03,37.21 18.57,36.67 STM32H743VI.34 25.88,36.67 v26.16,36.96
  Top 0.406: v25.78,17.78 28.83,14.73 28.83,5.33 J3.3 | R17.1 49.91,61.47 v31.11,61.47
  Bottom 0.305: v25.78,17.78 22.23,21.34 22.23,35.56 23.62,36.96 | 23.62,36.96 v26.16,36.96 | 23.62,36.96 23.62,40.39 24.13,40.89 24.13,42.93 22.23,44.83 22.23,50.55 28.83,57.15 30.35,57.15 31.11,57.91 v31.11,61.47
PB0_
  Top 0.254: STM32.18 68.26,18.2 68.26,16.57 J7.15
PB1  (via drill 0.3)
  Top 0.254: J1.21 5.84,35.94 8.13,35.94 8.36,36.17 STM32H743VI.35 25.8,36.17 v26.16,35.81
  Top 0.406: v27.05,17.78 29.72,15.11 29.72,7.11 32.51,4.32 J3.5
  Bottom 0.305: v27.05,17.78 22.99,21.84 22.99,34.29 24.51,35.81 v26.16,35.81
PB1_
  Top 0.254: STM32.19 68.71,17.93 68.71,16.32 68.26,15.88 68.26,14.03 J7.16
PB2
  Top 0.254: STM32H743VI.36 8.87,35.67 7.87,34.67 J1.24
PB2_
  Top 0.254: STM32.20 69.22,17.73 69.22,16.13 68.71,15.62 68.71,13.78 68.26,13.34 68.26,11.49 J7.17
PB3  (via drill 0.3)
  Top 0.254: J2.28 56.64,30.86 50.93,30.86 46.62,35.17 STM32H743VI.89 v39,35.17
  Bottom 0.305: v39,35.17 39,58.54 38.99,65.02
  Bottom 0.406: 38.99,65.02 J5.11
PB3_
  Top 0.254: STM32.39 80.77,27.88 J8.10
PB4
  Top 0.254: STM32H743VI.90 46.88,35.67 50.42,32.13 J2.25
PB4_
  Top 0.254: STM32.40 82.11,29.92 J8.9
PB5  (via drill 0.3)
  Top 0.254: STM32H743VI.91 47.14,36.17 49.91,33.4 v51.18,33.4 56.64,33.4 J2.26
  Top 0.406: v46.23,9.14 45.21,8.13 J3.15
  Bottom 0.406: v46.23,9.14 51.18,14.1 v51.18,33.4
PB5_
  Top 0.254: STM32.41 80.77,29.29 80.77,31.56 82.11,32.89 J8.8
PB6
  Top 0.254: STM32H743VI.92 47.4,36.67 49.4,34.67 J2.23
PB6_
  Top 0.254: STM32.42 80.33,29.55 80.33,31.75 80.77,32.19 80.77,34.16 J8.7
PB7  (via drill 0.3)
  Top 0.254: STM32H743VI.93 47.66,37.17 48.9,35.94 v51.18,35.94 56.64,35.94 J2.24
  Top 0.406: R18.1 47.89,62.73 v46.99,63.63
  Bottom 0.406: v51.18,35.94 51.18,54.48 46.99,58.67 v46.99,63.63
PB7_
  Top 0.254: STM32.43 79.82,29.75 79.82,31.94 80.33,32.45 80.33,34.42 80.71,34.8 80.71,36.64 J8.6
PB8
  Top 0.254: STM32H743VI.95 47.82,38.17 48.01,38.35 53.98,38.35 J2.19
PB8_
  Top 0.254: STM32.45 79.38,30.72 79.38,32.13 79.88,32.64 79.88,34.73 80.2,35.05 80.2,36.89 80.71,37.4 80.71,39.18 J8.5
PB9  (via drill 0.3)
  Top 0.254: STM32H743VI.96 45.78,38.67 47.37,40.26 52.2,40.26 v53.34,39.12
  Bottom 0.254: v53.34,39.12 53.98,38.48 56.64,38.48 J2.20
PB9_
  Top 0.254: STM32.46 78.87,30.92 78.87,32.38 79.44,32.96 79.44,34.99 79.76,35.31 79.76,37.15 80.26,37.66 80.26,39.5 80.71,39.94 80.71,41.72 J8.4
PB10  (via drill 0.3)
  Top 0.254: J1.34 9.02,23.88 9.02,24.64 15.05,30.67 STM32H743VI.46 25.59,30.67 v26.29,31.37 | 28.45,17.65 v28.45,17.78
  Top 0.406: 28.45,17.65 30.61,15.49 30.61,9.65 35.05,5.21 J3.7
  Bottom 0.254: v28.45,17.78 23.75,22.48 23.75,30.35 24.77,31.37 v26.29,31.37
PB10_
  Top 0.254: STM32.21 69.66,17.47 69.66,15.88 69.15,15.37 69.15,13.53 68.71,13.08 68.71,11.24 68.26,10.79 68.26,8.95 J7.18
PB11  (via drill 0.3)
  Top 0.254: J1.35 5.84,20.7 7.75,20.7 9.78,22.73 9.78,24.38 15.57,30.17 STM32H743VI.47 26.09,30.17 v26.29,30.35 | 37.59,4.83 J3.9
  Top 0.305: 37.59,4.83 31.5,10.92 31.5,16 v29.72,17.78
  Bottom 0.254: v29.72,17.78 24.64,22.86 24.64,29.72 25.27,30.35 v26.29,30.35
PB11_
  Top 0.254: STM32.22 70.17,17.27 70.17,15.68 69.66,15.18 69.66,13.34 69.22,12.89 69.22,10.99 68.77,10.54 68.77,8.76 68.26,8.26 68.26,6.41 J7.19
PB12  (via drill 0.3)
  Top 0.254: J1.36 7.62,19.94 7.75,19.94 14.22,26.41 25.02,26.42 v25.53,26.92 STM32H743VI.51 26.04,26.92
  Bottom 0.254: 30.86,13.46 30.86,17.91 25.53,23.24 v25.53,26.92
  Bottom 0.406: 30.86,13.46 J3.11
PB12_
  Top 0.254: STM32.25 78.04,16.62 78.04,15.18 78.55,14.67 78.55,13.02 79.06,12.51 79.06,10.6 79.57,10.1 79.57,8.19 80.07,7.68 80.07,6.16 80.58,5.65 80.58,4 J8.20
PB13  (via drill 0.3)
  Top 0.254: J1.37 5.84,18.16 7.87,18.16 8.51,18.8 8.51,19.94 14.48,25.91 26.8,25.91 27.01,26.12 STM32H743VI.52 27.01,27.98 v26.8,28.19
  Bottom 0.254: 31.5,15.49 31.5,18.03 26.8,22.73 v26.8,28.19
  Bottom 0.406: 31.5,15.49 40.39,6.48 J3.13
PB13_
  Top 0.254: STM32.26 78.55,16.82 78.55,15.43 79.06,14.92 79.06,13.27 79.57,12.76 79.57,10.86 80.07,10.35 80.07,8.45 80.58,7.94 80.58,6.54 J8.19
PB14  (via drill 0.3)
  Top 0.254: J1.38 7.62,16.89 9.14,18.41 9.14,19.81 14.73,25.4 26.92,25.4 27.51,25.99 STM32H743VI.53 27.51,28.27 v28.07,28.83 | 29.08,55.37 27.56,53.85 27.56,47.75 26.92,47.12 26.92,46.35 v26.16,45.59
  Top 0.305: J5.5 29.08,67.31 29.08,62.74 29.08,55.37
  Top 0.406: R29.1 42.29,62.74 29.08,62.74
  Bottom 0.254: 24.77,43.81 23.75,44.83 23.75,46.1 24.26,46.61 25.15,46.61 v26.16,45.59
  Bottom 0.305: v28.07,28.83 28.07,36.2 24.77,39.5 24.77,43.81
PB14_
  Top 0.254: STM32.27 79.06,17.02 79.06,15.68 79.57,15.18 79.57,13.53 80.07,13.02 80.07,11.11 80.58,10.6 80.58,9.08 J8.18
PB15  (via drill 0.3)
  Top 0.254: J1.39 5.84,15.62 7.87,15.62 9.65,17.4 9.65,19.56 14.99,24.89 27.05,24.89 28.01,25.85 STM32H743VI.54 28.01,27.76 28.96,28.7 v28.96,29.97 | 28.32,55.37 27.05,54.1 27.05,48.01 24.77,45.72 v24.77,45.59
  Top 0.305: J5.3 28.32,65.53 28.32,55.37
  Bottom 0.254: v28.96,29.97 28.96,36.2 25.4,39.75 25.4,44.96 v24.77,45.59
PB15_
  Top 0.254: STM32.28 79.57,17.22 79.57,15.94 80.07,15.43 80.07,13.78 80.58,13.27 80.58,11.62 J8.17
PB16
  Top 0.254: STM32F103CB.28 25.25,83.17 24.7,83.72 24.7,85.44 25.27,86.01 25.27,88.96 PWR_ENN.TP
PC0  (via drill 0.3)
  Top 0.254: STM32H743VI.15 31.51,41.16 v31.5,41.02 | 9.02,54.99 13.34,50.67 15.75,50.67 17.14,49.28 23.24,49.28 v23.5,49.02
  Top 0.406: J1.8 9.02,54.99
  Bottom 0.254: v23.5,49.02 25.91,46.61 27.94,46.61 31.5,43.05 v31.5,41.02 | 43.94,5.33 43.94,2.92 J3.16
  Bottom 0.305: 37.97,31.62 31.62,37.97 31.62,40.89 v31.5,41.02
  Bottom 0.406: 43.94,5.33 37.97,11.3 37.97,31.62
PC1  (via drill 0.3)
  Top 0.254: STM32H743VI.16 31.01,47.85 28.45,50.42 v28.32,50.42 | v26.29,50.42 26.16,50.42 23.37,47.62 17.91,47.62 15.49,50.04 11.56,50.04 7.87,53.72 5.84,53.72 J1.7
  Bottom 0.406: v28.32,50.42 v26.29,50.42
PC2  (via drill 0.3)
  Top 0.254: v28.32,49.4 28.57,49.4 30.51,47.47 STM32H743VI.17 30.51,40.48 v30.86,40.13 | v26.29,49.4 23.75,46.86 17.91,46.86 15.37,49.4 10.92,49.4 7.87,52.45 J1.10 | 38.86,5.46 38.86,2.92 J3.12
  Top 0.305: 38.86,5.46 32.13,12.19 32.13,16 v33.02,16.89
  Bottom 0.254: v33.02,16.89 33.02,18.03 30.48,20.57 30.48,24.13 30.86,24.51 v30.86,40.13
  Bottom 0.406: v28.32,49.4 v26.29,49.4
PC3  (via drill 0.3)
  Top 0.254: v28.32,48.39 28.83,48.39 30.01,47.2 STM32H743VI.18 30.01,40.43 v29.72,40.13 | v26.29,48.39 23.88,45.97 17.91,45.97 15.11,48.77 10.29,48.77 7.87,51.18 5.84,51.18 J1.9 | 41.4,5.59 41.4,2.92 J3.14
  Top 0.305: 41.4,5.59 33.02,13.97 v33.02,15.24
  Bottom 0.254: v33.02,15.24 32.13,16.13 32.13,18.16 29.72,20.57 v29.72,40.13
  Bottom 0.406: v28.32,48.39 v26.29,48.39
PC4
  Top 0.254: STM32H743VI.32 18.97,37.67 16.89,39.75 J1.20
PC5
  Top 0.254: STM32H743VI.33 18.71,37.17 17.4,38.48 5.84,38.48 J1.19
PC6
  Top 0.254: STM32H743VI.63 32.51,18.92 37.34,14.1 45.34,14.1 54.74,4.7 55.12,4.45 J2.47
PC7
  Top 0.254: STM32H743VI.64 33.01,19.18 37.47,14.73 45.85,14.73 53.72,6.86 53.72,6.48 54.74,5.46 56.64,5.46 J2.48
PC8
  Top 0.254: STM32H743VI.65 33.51,19.45 37.59,15.37 46.35,15.37 54.74,6.99 55.12,6.99 J2.45
PC9
  Top 0.254: STM32H743VI.66 34.01,19.71 37.72,16 46.74,16 54.74,8 56.64,8 J2.46
PC10
  Top 0.254: STM32H743VI.78 42.59,29.67 J2.37
PC11
  Top 0.254: STM32H743VI.79 43.49,30.17 53.47,20.19 53.47,19.56 54.86,18.16 56.64,18.16 J2.38
PC12
  Top 0.254: STM32H743VI.80 44.13,30.67 J2.35
PC13  (via drill 0.3)
  Top 0.254: J2.12 56.64,51.18 49.28,51.18 45.21,47.12 42.67,47.12 40.51,44.96 35.69,44.96 35.51,44.78 STM32H743VI.7 35.51,41.35 v35.18,41.15
  Top 0.305: R31.1 42.66,24.65 v39.62,27.69
  Bottom 0.254: v39.62,27.69 39.62,32.38 34.92,37.08 34.92,37.85 33.27,39.5 33.27,41.27 33.66,41.66 34.67,41.66 v35.18,41.15
PC13_
  Top 0.254: STM32.2 72.58,29.15 72.58,30.04 73.98,31.43 73.98,35.75 72.9,36.83 72.07,36.83 68.77,40.13 68.77,41.21 J7.4
PC14
  Top 0.254: STM32H743VI.8 35.01,45.17 35.31,45.47 39.88,45.47 42.16,47.75 43.94,47.75 Q2.2
  Top 0.406: Q2.2 46.61,50.41 46.61,52.45 | C4.2 46.61,52.45 | 46.61,52.45 J2.9
PC14_  (via drill 0.3)
  Top 0.254: STM32.3 72.14,28.89 72.14,30.35 73.53,31.75 73.53,34.67 v73.22,34.99 72.45,34.99 J7.5
  Bottom 0.305: 74.11,37.47 76.96,37.47
  Bottom 0.406: v73.22,34.99 C36.2 74.11,37.47 | 76.96,37.47 Q5.2
PC15  (via drill 0.3)
  Top 0.254: STM32H743VI.9 34.51,45.43 35.05,45.97 39.62,45.97 Q2.1 | v48.77,54.1 49.15,53.72 56.64,53.72 J2.10
  Top 0.406: Q2.1 42.55,52.96 v41.4,54.1 41.02,54.47 C3.2
  Bottom 0.61: v48.77,54.1 v41.4,54.1
PC15_  (via drill 0.3)
  Top 0.254: STM32.4 71.69,28.63 71.69,30.54 73.09,31.94 73.09,33.02 v72.2,33.91 70.99,33.91 J7.6
  Bottom 0.406: Q5.1 77.86,36.56 C35.2 75.77,33.91 v72.2,33.91
PD0
  Top 0.254: STM32H743VI.81 44.39,31.17 54.86,20.7 56.64,20.7 J2.36
PD1
  Top 0.254: STM32H743VI.82 44.78,31.67 54.48,21.97 J2.33
PD2
  Top 0.254: STM32H743VI.83 45.05,32.17 53.98,23.24 56.64,23.24 J2.34
PD3
  Top 0.254: STM32H743VI.84 45.31,32.67 53.47,24.51 J2.31
PD4
  Top 0.254: STM32H743VI.85 45.57,33.17 52.96,25.78 56.64,25.78 J2.32
PD5
  Top 0.254: STM32H743VI.86 45.83,33.67 52.45,27.05 J2.29
PD6
  Top 0.254: STM32H743VI.87 46.09,34.17 51.94,28.32 56.64,28.32 J2.30
PD7
  Top 0.254: STM32H743VI.88 46.35,34.67 51.44,29.59 J2.27
PD8
  Top 0.254: STM32H743VI.55 28.51,25.72 27.18,24.38 15.24,24.38 10.16,19.3 10.16,17.02 8,14.86 7.62,14.86 J1.40
PD9
  Top 0.254: STM32H743VI.56 29.01,25.58 27.3,23.88 15.49,23.88 10.67,19.05 10.67,15.88 7.87,13.08 5.84,13.08 J1.41
PD10
  Top 0.254: STM32H743VI.57 29.51,25.45 27.43,23.37 15.75,23.37 11.18,18.8 11.18,15.62 7.87,12.32 7.62,12.32 J1.42
PD11
  Top 0.254: STM32H743VI.58 30.01,25.31 27.56,22.86 16.38,22.86 15.88,22.35 15.88,19.18 8.51,11.81 8.51,11.3 7.75,10.54 5.84,10.54 J1.43
PD12
  Top 0.254: STM32H743VI.59 30.51,25.05 27.69,22.23 16.76,22.23 16.51,21.97 16.51,19.05 9.14,11.68 9.14,11.05 7.75,9.65 7.49,9.65 J1.44
PD13
  Top 0.254: STM32H743VI.60 31.01,24.92 27.81,21.72 17.27,21.72 17.14,21.59 17.14,18.8 9.78,11.43 9.78,10.03 7.75,8 5.84,8 J1.45
PD14
  Top 0.254: STM32H743VI.61 31.51,24.78 27.94,21.21 22.48,21.21 19.05,17.78 17.02,17.78 10.54,11.3 10.54,9.91 7.75,7.11 7.49,7.11 J1.46
PD15
  Top 0.254: STM32H743VI.62 32.01,24.52 28.07,20.57 22.86,20.57 19.43,17.14 17.27,17.14 11.3,11.18 11.3,8.89 7.87,5.46 5.84,5.46 J1.47
PE0
  Top 0.254: STM32H743VI.97 45.39,39.17 46.86,40.64 46.86,41.27 47.37,41.78 54.86,41.78 J2.17
PE1  (via drill 0.3)
  Top 0.254: STM32H743VI.98 44.75,39.67 45.97,40.89 v45.97,41.02 | v47.75,41.02 56.64,41.02 J2.18
  Bottom 0.61: v45.97,41.02 v47.75,41.02
PE2
  Top 0.254: STM32H743VI.1 39.02,42.93 42.42,42.93 43.69,44.2 46.86,44.2 47.5,44.83 J2.15
PE3
  Top 0.254: STM32H743VI.2 38.01,41.49 38.1,41.4 38.86,41.4 39.88,42.42 42.93,42.42 44.07,43.56 56.64,43.56 J2.16
PE4
  Top 0.254: STM32H743VI.3 37.51,43.23 37.72,43.43 42.04,43.43 43.43,44.83 46.48,44.83 49.02,47.37 J2.13
PE5
  Top 0.254: STM32H743VI.4 37.01,43.74 37.21,43.94 41.53,43.94 43.18,45.59 45.97,45.59 49.02,48.64 56.64,48.64 J2.14
PE6
  Top 0.254: STM32H743VI.5 36.51,44.26 36.7,44.45 41.02,44.45 42.93,46.35 45.59,46.35 49.15,49.91 J2.11
PE7
  Top 0.254: STM32H743VI.37 9.77,35.17 8,33.4 5.84,33.4 J1.25
PE8
  Top 0.254: STM32H743VI.38 10.16,34.67 7.75,32.26 7.24,32.26 J1.26
PE9
  Top 0.254: STM32H743VI.39 11.06,34.17 7.75,30.86 5.84,30.86 J1.27
PE10
  Top 0.254: STM32H743VI.40 11.45,33.67 7.37,29.59 J1.28
PE11
  Top 0.254: STM32H743VI.41 12.72,33.17 7.87,28.32 5.84,28.32 J1.29
PE12
  Top 0.254: STM32H743VI.42 12.99,32.67 7.62,27.3 7.37,27.3 J1.30
PE13
  Top 0.254: STM32H743VI.43 14.26,32.17 7.87,25.78 5.84,25.78 J1.31
PE14
  Top 0.254: STM32H743VI.44 14.53,31.67 7.37,24.51 J1.32
PE15
  Top 0.254: STM32H743VI.45 14.79,31.17 8.51,24.89 8.51,24 7.75,23.24 5.84,23.24 J1.33
PF0_  (via drill 0.3)
  Top 0.254: STM32.5 71.25,28.37 71.25,31.11 v71.5,31.3
  Bottom 0.406: v71.5,31.3 73.72,31.3 74.93,32.51 Q3.2 77.52,32.5 C27.2
PF1_
  Top 0.254: STM32.6 70.8,28.1 70.8,31.94 71.37,32.51 Q3.1
  Bottom 0.406: C28.1 71.58,32.5 Q3.1
PH0  (via drill 0.8 pad 1.68)
  Top 0.813: J2.7 v52.7,54.99
  Bottom 0.813: J2.7 v52.7,54.99
PH1  (via drill 0.8 pad 1.68)
  Top 0.305: J2.8 56.64,56.26 53.91,56.26
  Top 0.813: 53.91,56.26 v52.7,57.47
  Bottom 0.305: J2.8 56.64,56.26 53.91,56.26
  Bottom 0.813: 53.91,56.26 v52.7,57.47
PWR_EXT
  Top 0.254: STM32F103CB.39 28.6,75.59 28.57,75.56
  Top 0.406: PWR_EXT.TP 28.42,75.56 28.57,75.56 R30.1
ST-LINK+5V
  Top 0.813: D2.A 25.15,60.95 22.35,63.75 J5.1
ST_+3V3  (via drill 0.3)
  Top 0.254: C21.1 25.32,79.17 STM32F103CB.36 28.68,79.17 v28.7,79.25 | v32.38,83.44 32.72,83.17 STM32F103CB.9 35.29,83.17 36.45,84.33 C20.1 | C19.1 29.27,88.58 29.25,88.58 27.6,86.94 STM32F103CB.24 27.6,85.11 v27.62,84.84 | v33.91,78.49 33.89,78.49 | C22.2 34.8,77.6 v33.91,78.49 | STM32F103CB.1 34.59,79.17 v33.91,78.49 | v33.91,78.49 33.91,78.47 STM32F103CB.48
  Top 0.61: T1.3 17.75,74.8 21.94,74.8 23.97,76.83 C21.1 | v41.78,76.07 42.8,75.06 50.16,75.06 51.44,76.33 CN2.1 | R19.2 16.64,84.58 v15.24,85.98 14.99,86.23 14.99,88.52 | R7.2 36.7,86.48 | 36.7,86.48 R11.2 | C20.1 36.7,86.48 | R23.2 16.36,89.27 C25.1 14.99,88.52 | U2.5 14.93,88.58 14.99,88.52
  Bottom 0.61: 28.7,83.44 v28.7,79.25 29.46,78.49 v33.91,78.49 36.7,78.49 39.12,76.07 v41.78,76.07 | v32.38,83.44 28.7,83.44 | 28.7,83.44 28.7,83.76 v27.62,84.84 27.37,84.96 16.26,84.96 v15.24,85.98
ST_+5V  (via drill 0.3)
  Top 0.406: U2.3 10.61,86.68 | ST_USB.1 7.78,82.96 8.04,83.23
  Top 0.61: CN2.3 51.21,78.9 49.91,77.6 v49.78,77.6 | D3.3 14.16,79.35 v13.24,80.26 | 5.44,89.27 C26.2 | 9.82,89.27 U2.1 11.24,88.58 11.94,87.88 11.94,87.38 11.24,86.68 10.61,86.68 | 8.04,83.23 v9.65,84.84 10.51,85.69 U2.3 | R26.2 21.72,81.79 v22.23,81.28
  Top 0.813: 5.44,89.27 C24.2 9.82,89.27
  Bottom 0.61: 20.07,81.53 18.03,81.53 16.13,79.38 14.13,79.38 v13.24,80.26 11.91,81.6 9.65,83.82 v9.65,84.84 | 20.07,81.53 20.07,78.23 23.24,75.06 | 23.24,75.06 46.74,75.06 49.28,77.6 v49.78,77.6 | J5.2 22.35,74.17 23.24,75.06 | 20.07,81.53 21.97,81.53 v22.23,81.28
ST_GND  (via drill 0.3)  (1 unrouted)
  Top 0.254: 24.1,79.67 C21.2 24,79.67 STM32F103CB.35 27.91,79.67 28.42,80.17 29.21,80.17 29.53,79.85 31.1,79.85 | C20.2 36.42,82.67 STM32F103CB.8 33.39,82.67 32.6,81.88 STM32F103CB.47 32.6,76.67 32,76.07 32,75.56 | STM32F103CB.44 31.1,79.85 | 31.1,79.85 32.64,79.85 32.64,79.88 | STM32F103CB.23 28.1,85.37 28.45,85.03 29.21,85.03 29.6,85.42 STM32F103CB.20 29.6,87.13 30.54,88.08 30.54,89.6 29.77,90.37 C19.2
  Top 0.305: 24.1,79.66 C21.2 | 32,75.56 R30.2
  Top 0.406: 22.61,91.82 22.62,91.61 LED3.C 21.35,88.65 18.28,88.65 17.01,87.38 R20.2 | C16.2 37.87,84.08 C20.2 | ST_USB.M4 ST_USB.5
  Top 0.61: 24.1,79.66 23.24,79.63 22.73,79.12 22.73,77.34 21.2,75.81 R27.1 19.7,75.81 v19.43,76.07 | C18.2 40.77,78.74 40.77,77.22 | 40.77,77.22 40.77,75.69 40.26,75.18 R22.2 R21.1 C22.1 32.41,75.17 R30.2 | R8.1 | 40.77,77.22 43.69,77.22 44.58,78.11 44.58,79.38 45.34,80.14 49.91,80.14 51.21,81.44 CN2.5 56.64,81.41 57.15,80.9 57.15,72.01 56.64,71.5 J5.16 | C24.1 8.26,91.82 | 9.27,87.57 U2.2 | C25.2 14.99,91.82
  Top 0.813: 29.53,91.82 R8.1 C11.2 | 29.53,91.82 22.61,91.82 14.99,91.82 8.26,91.82 4.83,91.82 C26.1 | C11.2 39.75,91.82 43.81,87.76 50.16,87.76 51.37,86.52 CN2.9 | D3.1 12.37,76.83 | ST_USB.M4 4.76,80.07 | 29.53,91.82 C19.2
  Top 1.016: CN2.9 CN2.7 CN2.5 | ST_USB.M2 2.03,85.34
  Top 1.27: ST_USB.M2 ST_USB.M3 9.27,87.57 | R10.2 10.2,77.17 | R10.2 6.84,77.17 ST_USB.M4 ST_USB.M1 2.03,85.34 2.03,88.96 C26.1 | 12.37,76.83 11.24,76.83 | 11.24,76.83 10.21,76.83 R10.2 | v11.3,76.07 11.3,76.77 11.24,76.83
  Bottom 0.813: v11.3,76.07 v19.43,76.07
STLINK_RX  (via drill 0.3)
  Top 0.254: STM32F103CB.13 33.1,86.76
  Top 0.305: 33.1,86.76 v34.35,88.01
  Top 0.61: R24.2 42.41,91.57 v42.16,91.57
  Bottom 0.406: v42.16,91.57 37.91,91.57 v34.35,88.01
STLINK_RX_H  (via drill 0.3)
  Top 0.254: 51.21,89.06 CN2.11
  Top 0.406: 51.21,89.06 49.59,90.68 R24.1
  Top 0.61: CN2.11 v57.15,89.03
  Bottom 0.305: 27.94,73.66 56.01,73.66
  Bottom 0.406: J5.6 27.43,73.15 27.94,73.66 | 56.01,73.66 57.15,74.8 v57.15,89.03
STLINK_TX  (via drill 0.3)
  Top 0.254: v34.54,85.34 34.54,84.71 STM32F103CB.12
  Top 0.406: R25.2 v45.59,89.03
  Bottom 0.406: v45.59,89.03 41.91,85.34 v34.54,85.34
STLINK_TX_H  (via drill 0.3)
  Top 0.61: R25.1 v49.78,89.03
  Bottom 0.254: 52.83,89.03 CN2.12
  Bottom 0.305: 25.4,74.3 55.5,74.3
  Bottom 0.406: J5.4 24.89,73.79 25.4,74.3 | 55.5,74.3 56.26,75.06 56.26,88.77 56.01,89.03 52.83,89.03
  Bottom 0.61: v49.78,89.03 CN2.12
STM_JTCK
  Top 0.254: STM_JTCK.TP 24.92,76.36 26.23,77.67 STM32F103CB.37
STM_JTMS  (via drill 0.3)
  Top 0.254: STM32F103CB.34 27.14,80.17 v27.62,80.64
  Top 0.406: v26.51,76.52 STM_JTMS.TP
  Bottom 0.406: v27.62,80.64 27.62,77.63 v26.51,76.52
T_JTCK  (via drill 0.3)
  Top 0.254: STM32F103CB.26 29.65,84.17 30.45,84.96 v32,84.96 32.1,85.06 STM32F103CB.15
  Top 0.406: v45.59,78.87 R15.2
  Bottom 0.406: v45.59,78.87 45.09,79.38 41.02,83.31 34.54,83.31 32.89,84.96 v32,84.96
T_JTCK_H  (via drill 0.3)
  Top 0.305: J5.10 32.51,72.9 33.15,73.53 54.23,73.53 55.37,74.68 v55.37,77.98
  Top 0.61: R15.1 v49.78,78.87
  Bottom 0.254: 54.45,78.9 CN2.4
  Bottom 0.406: v55.37,77.98 54.45,78.9
  Bottom 0.61: v49.78,78.87 CN2.4
T_JTDI
  Top 0.254: STM32F103CB.17 31.11,87.31 32.13,88.33 T_JTDI.TP
T_JTDO  (via drill 0.3)
  Top 0.254: STM32F103CB.16 31.6,86.85 v32.13,87.38
  Top 0.305: 47.62,85.22 47.62,82.8
  Top 0.406: 47.62,82.8 46.74,81.92 R16.2 | v41.4,86.87 43.05,85.22 47.62,85.22
  Bottom 0.406: v32.13,87.38 32.89,87.38 33.4,86.87 v41.4,86.87
T_JTDO_H  (via drill 0.3)
  Top 0.61: R16.1 v49.78,81.41
  Bottom 0.61: v49.78,81.41 CN2.6
T_JTMS  (via drill 0.3)
  Top 0.254: R9.2 25.78,89.15 25.78,85.81 25.21,85.24 25.21,83.95 25.49,83.67 STM32F103CB.27 30.57,83.67 31.11,83.12 v31.11,80.96
  Top 0.406: v45.59,76.33 R14.2
  Bottom 0.406: v31.11,80.96 32.19,79.88 38.54,79.88 40.96,77.47 44.42,77.47 v45.59,76.33
T_JTMS_H  (via drill 0.3)
  Top 0.305: v52.7,75.06 51.82,74.17 30.48,74.17 29.97,73.66 J5.8
  Top 0.61: R14.1 v49.78,76.33
  Bottom 0.61: v49.78,76.33 CN2.2 v52.7,75.06
T_NRST
  Top 0.254: STM32F103CB.18 30.6,87.5 31.18,88.08
  Top 0.305: R13.2 43.56,86.49 39.12,90.93 31.62,90.93 31.18,90.49 31.18,88.08
T_NRST_H  (via drill 0.3)
  Top 0.61: R13.1 v49.78,86.49 | v55.37,86.49 v58.17,86.49
  Bottom 0.305: J5.14 38.99,72.9 56.39,72.9 58.17,74.68 v58.17,86.49
  Bottom 0.61: v49.78,86.49 CN2.10 v55.37,86.49
T_SWDIO_IN
  Top 0.254: R9.1 26.99,88.58 26.67,88.27 26.67,85.23 STM32F103CB.25
T_SWO  (via drill 0.3)
  Top 0.254: STM32F103CB.31 29.44,81.67 v29.84,82.07
  Top 0.406: v41.02,81.79 44.2,81.79 46.35,83.95 R12.2
  Bottom 0.406: v29.84,82.07 40.73,82.07 v41.02,81.79
T_SWO_H  (via drill 0.3)
  Top 0.305: J5.12 36.45,72.9 54.86,72.9 56.26,74.3 56.26,79.38 55.5,80.14 v55.24,80.14
  Top 0.61: R12.1 v49.78,83.95
  Bottom 0.406: CN2.8 54.83,83.98 55.24,83.57 v55.24,80.14
  Bottom 0.61: v49.78,83.95 CN2.8
USB_DM
  Top 0.254: STM32F103CB.32 24.47,81.17 24.38,81.28
  Top 0.305: 15.11,83.44 22.23,83.44 24.38,81.28
  Top 0.406: R4.2 14.48,84.07 15.11,83.44
USB_DP
  Top 0.254: STM32F103CB.33 23.89,80.67 21.65,82.9
  Top 0.305: 21.65,82.9 16.51,82.9 | 16.51,82.9 14.71,82.9 | 16.38,82.8 16.51,82.9
  Top 0.406: R5.2 14.71,82.9 | R6.2 16.38,82.8
USB_RENUMN  (via drill 0.3)
  Top 0.254: v26.04,78.49 26.16,78.61 27.94,78.61 28.1,78.45 STM32F103CB.38
  Top 0.406: R28.2 21.34,79.38 v22.23,80.26
  Bottom 0.406: v26.04,78.49 24,78.49 v22.23,80.26
VBUS  (via drill 0.3)
  Top 0.406: USB.1 15.97,6.96 17.91,8.89 v17.91,9.4
  Top 0.61: VD1.5 v22.86,10.41 | C12.2 v25.4,10.79 25.4,11.42 D1.A
  Bottom 0.61: v17.91,9.4 18.92,10.41 v22.86,10.41 25.02,10.41 v25.4,10.79
VBUS_  (via drill 0.3)
  Top 0.406: v78.04,12.38 77.85,12.64 77.85,14.1 77.28,14.86 v77.28,16 77.28,16.38 75.69,17.97 v72.58,17.97 | v76.83,30.73 75.63,31.94 75.63,38.04 80.14,42.55 80.14,43.69 J8.3 | USB_.1 73.19,5.5 73.06,5.62
  Top 0.61: 73.06,5.62 70.36,8.32 v70.36,8.89
  Bottom 0.254: 77.2,15.93 v77.28,16
  Bottom 0.406: VD2.5 78.11,12.32 v78.04,12.38 | v72.58,17.97 70.29,17.97 70.29,21.27 71.5,22.48 72.83,22.48 73.98,23.62 73.98,24.7 75.25,25.97 76.83,25.97 v76.83,30.73 | 69.41,7.23 U3.3 | R39.2 77.2,15.93
  Bottom 0.61: 70.29,17.97 69.41,17.08 69.41,8.89 | 69.41,8.89 69.41,7.23 | v70.36,8.89 69.41,8.89
VCAP1
  Top 0.254: STM32H743VI.48 17.72,29.67 C14.1
VCAP2
  Top 0.254: STM32H743VI.73 37.51,20.64 C13.1
X0  (via drill 0.8 pad 1.68)
  Bottom 0.813: J7.0 v69.41,53.28
X1  (via drill 0.8 pad 1.68)
  Bottom 0.813: J8.0 v79.31,53.28

## Text on the board
Bottom: ST-LINK v2-1 | H7-DISCO
tNames: RX | by Utyf | GND | GND | GND | +5V | +3V | ST-LINK v2-1 | +5V | TX | RX | TMS | TCK | SWO | NRST | GND | +5V | RX | TX | TMS | TCK | SWO | NRST | GND | GND | GND | GND | GND | +3V | +5V | +3V | +5V | +3V | GND | NRST | +3V | PC1 | PC0 | +3V | PC3 | PC14 | X0 | X1 | PC2 | PC15 | PA1 | PA0 | PE6 | PC13 | 3V | 3V | PA3 | PE4 | G | SWD | G | PA2 | PE5 | PA5 | PE2 | RS | 5V | PA4 | PE3 | PA7 | PA6 | PE0 | PE1 | C13 | B9 | BOOT0 | PC5 | PB8 | C14 | B8 | PC4 | PB9 | PB1 | BOOT0 | PB0 | +3V | C15 | B7 | GND | PB6 | A0 | B6 | PB2 | PB7 | PE7 | PB4 | PE8 | PB5 | A1 | B5 | PE9 | PD7 | A2 | B4 | PE10 | PB3 | PE11 | PE12 | PD5 | PD6 | A3 | B3 | PE13 | H7-DISCO | PD3 | A4 | PE14 | PD4 | A15 | PE15 | PB10 | by Utyf | PD1 | PD2 | A5 | A12 | PB11 | PC12 | A6 | PB12 | PD0 | A11 | PB13 | PB14 | PC10 | PC11 | A7 | A10 | PB15 | PA14 | B0 | PD8 | PA15 | A9 | PD9 | PA10 | B1 | A8 | PD10 | PA13 | by Utyf | PD11 | PA8 | B2 | PD12 | D0 | D1 | D2 | D3 | D4 | D5 | D6 | D7 | PA9 | B15 | GND | +3V | PD13 | PC8 | B10 | PD14 | +5V | +5V | RST | CLK | DIR | NXT | STP | PC9 | B14 | PD15 | PC6 | NRST | PC7 | B11 | B13 | ULPI | GND | G | GND | GND | GND | B12
bNames: TX | NRST | SWO | TDO | TCK | TMS | 3V | DIO | CLK | G